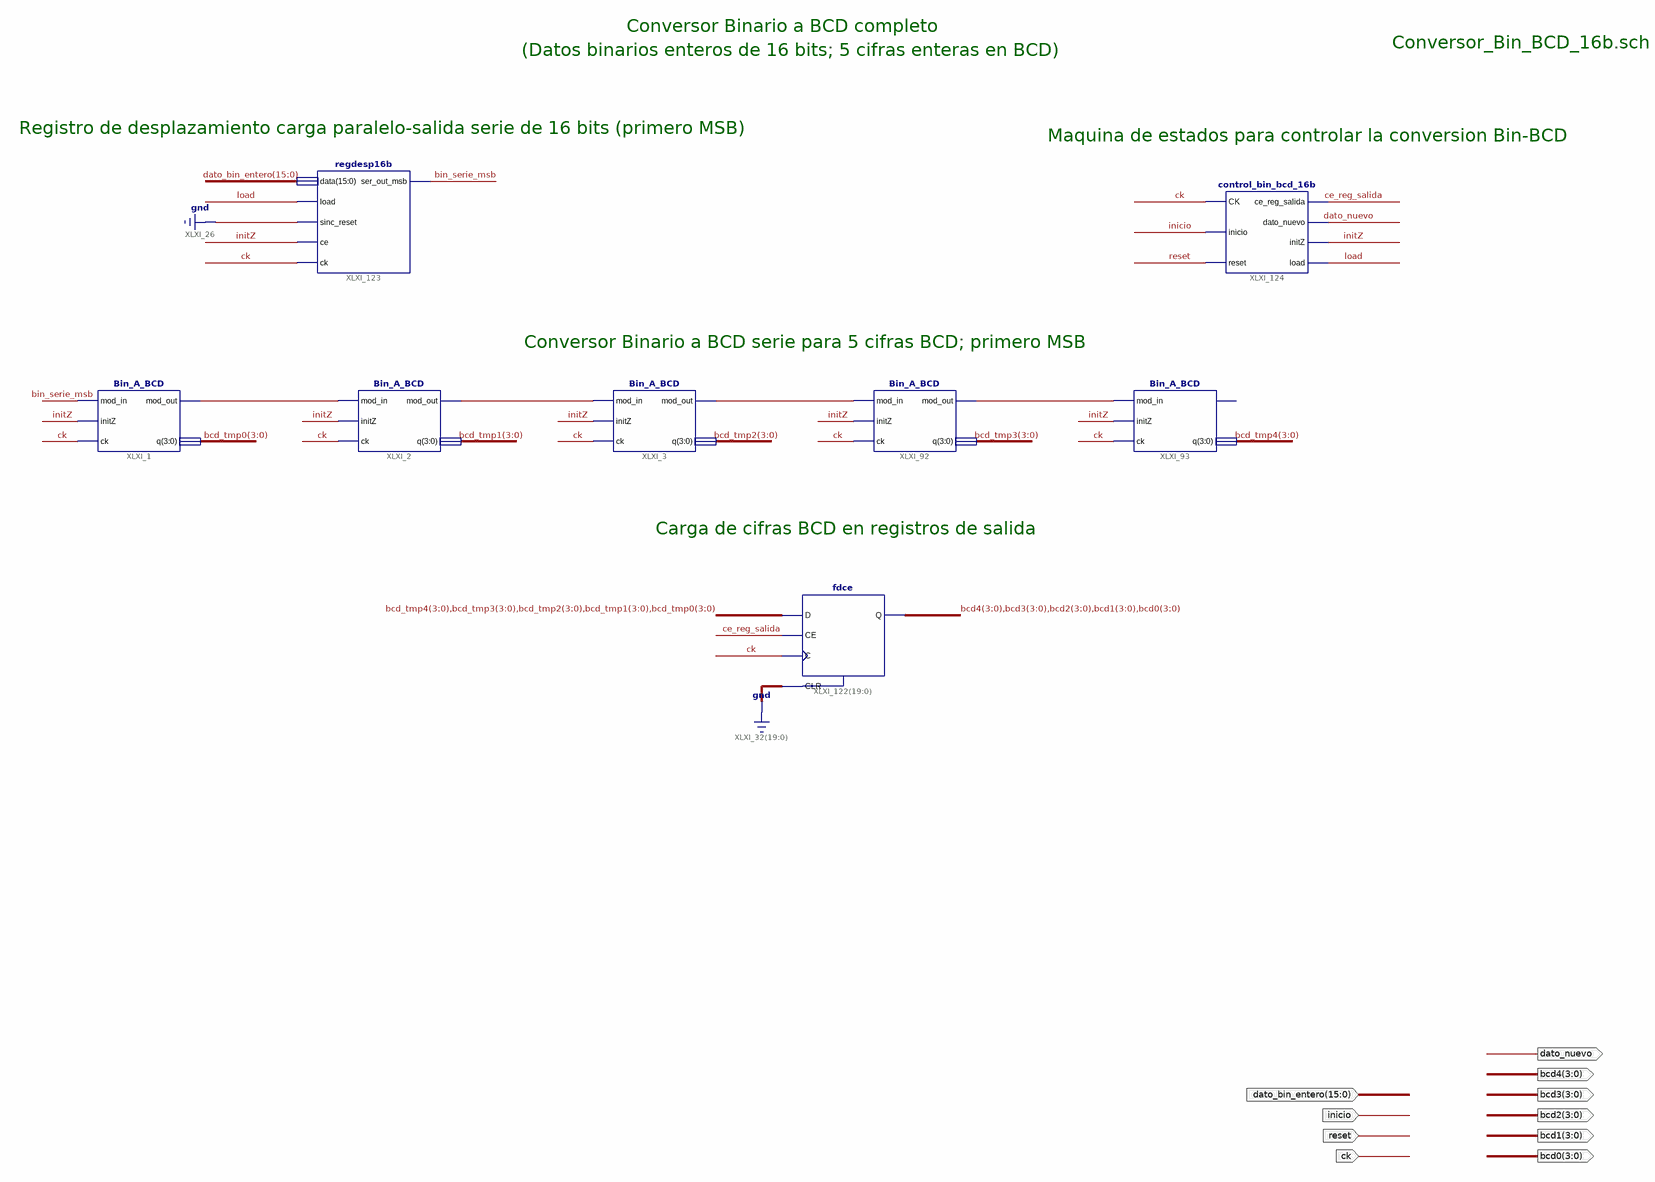
[diagram p0: schematic sheet 1]
// Xilinx ISE schematic Conversor_Bin_BCD_16b.sch (spartan6) as structural Verilog: 8 symbols, 10 ports
module Conversor_Bin_BCD_16b (
  input  ck,
  input  inicio,
  input  reset,
  input  [15:0] dato_bin_entero,
  output dato_nuevo,
  output [3:0] bcd0,
  output [3:0] bcd1,
  output [3:0] bcd2,
  output [3:0] bcd3,
  output [3:0] bcd4
);

  wire bin_serie_msb, ce_reg_salida, initZ, load, XLXN_8, XLXN_9, XLXN_563, XLXN_564;
  wire [3:0] bcd_tmp0, bcd_tmp1, bcd_tmp2, bcd_tmp3, bcd_tmp4;

  Bin_A_BCD XLXI_2 (.mod_out(XLXN_8), .q(bcd_tmp1), .mod_in(XLXN_9), .initZ(initZ), .ck(ck));
  Bin_A_BCD XLXI_1 (.mod_out(XLXN_9), .q(bcd_tmp0), .mod_in(bin_serie_msb), .initZ(initZ), .ck(ck));
  Bin_A_BCD XLXI_3 (.mod_out(XLXN_564), .q(bcd_tmp2), .mod_in(XLXN_8), .initZ(initZ), .ck(ck));
  Bin_A_BCD XLXI_92 (.mod_out(XLXN_563), .q(bcd_tmp3), .mod_in(XLXN_564), .initZ(initZ), .ck(ck));
  Bin_A_BCD XLXI_93 (.q(bcd_tmp4), .mod_in(XLXN_563), .initZ(initZ), .ck(ck));  // open: mod_out
  regdesp16b XLXI_123 (
    .sinc_reset(1'b0), .ce(initZ), .ck(ck), .data(dato_bin_entero), .load(load), .ser_out_msb(bin_serie_msb));
  control_bin_bcd_16b XLXI_124 (
    .CK(ck), .ce_reg_salida(ce_reg_salida), .dato_nuevo(dato_nuevo), .initZ(initZ), .load(load),
    .inicio(inicio), .reset(reset));
  fdce XLXI_122[19:0] (
    .C(ck), .CE(ce_reg_salida), .CLR({20{1'b0}}), .D({bcd_tmp4, bcd_tmp3, bcd_tmp2, bcd_tmp1, bcd_tmp0}),
    .Q({bcd4, bcd3, bcd2, bcd1, bcd0}));

  // Notes on the sheet:
  //   Conversor Binario a BCD completo
  //   Conversor_Bin_BCD_16b.sch
  //   (Datos binarios enteros de 16 bits; 5 cifras enteras en BCD)
  //   Registro de desplazamiento carga paralelo-salida serie de 16 bits (primero MSB)
  //   Maquina de estados para controlar la conversion Bin-BCD
  //   Conversor Binario a BCD serie para 5 cifras BCD; primero MSB
  //   Carga de cifras BCD en registros de salida
endmodule
